# Altium schematic sheet Olivia_LEDProject.SchDoc
size A
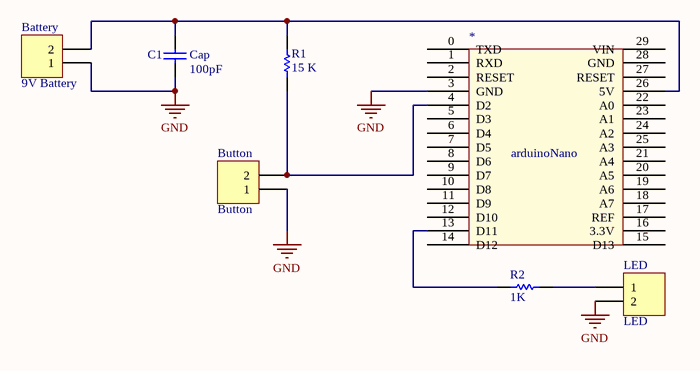
[diagram p0: Olivia_LEDProject.SchDoc]

## Parts
*  arduinoNano  [Arduino nano]
Battery  9V Battery  [HDR1X2]
Button  Button  [HDR1X2]
C1  Cap  value 100pF  [RAD-0.3]
LED  LED  [HDR1X2]
R1  15 K  [YFDZ-MFJRY13-2_M]
R2  1K  [YFDZ-MFJRY13-2_M]

## Nets
GND: *.3(GND) Battery.1 Button.1 C1.2 LED.2
Net*_4: *.4(D2) Button.2 R1.1
Net*_13: *.13(D11) R2.2
Net*_26: *.26(5V) Battery.2 C1.1 R1.2
NetLED_1: LED.1 R2.1

Not connected (* = marked no-connect by the designer): * 0(TXD) 1(RXD) 2(RESET) 5(D3) 6(D4) 7(D5) 8(D6) 9(D7) 10(D8) 11(D9) 12(D10) 14(D12) 15(D13) 16(3.3V) 17(REF) 18(A7) 19(A6) 20(A5) 21(A4) 22(A0) 23(A1) 24(A2) 25(A3) 27(RESET) 28(GND) 29(VIN)

## Library data of the parts
Battery Button LED = Header 2: Header, 2-Pin; LatestRevisionDate: 17-Jul-2002; LatestRevisionNote: Re-released for DXP Platform.; Publisher: Altium Limited
C1 = Cap: Capacitor; Published: 8-Jun-2000; LatestRevisionDate: 17-Jul-2002; LatestRevisionNote: Re-released for DXP Platform.; PackageReference: RAD-0.3; Publisher: Altium Limited; PackageDescription: Radial Cap, Thru-Hole; 2 Leads; 0.3 in Pin Spacing
R1 R2 = CMP-0923-00002-1: Metal Film Fixed Resistor, 51 KOhm +/- 5%, -55 to 155 degC, 2-Pin THD, Dia 1.7 mm, Body Length 3.2 mm, RoHS; PartNumber: MFJRY13T52051K00; Manufacturer: YingFa Electronics; Pulsed Voltage (Max.) (V): 300; Operating Voltage (Max.) (V): 150; Accuracy: +/- 5%; Resistance (Ohm): 51000; Insulation Voltage (Max.) (V): 200; Temperature Range: -55 to 155 degC; ComponentLink2Description: Datasheet; PackageReference: MFJRY13-2; RoHS: TRUE; Load Voltage (Max.) (V): 300; Mounting Technology: Through Hole; ComponentLink1Description: Manufacturer URL; PackageDescription: 2-Pin Through Hole Resistor, Dia 1.7 mm, Body Length 3.2 mm; ComponentLink2URL: http://www.szyfdz.net/mojinshuyanghuamodianzu/; ComponentLink1URL: http://www.szyfdz.net/